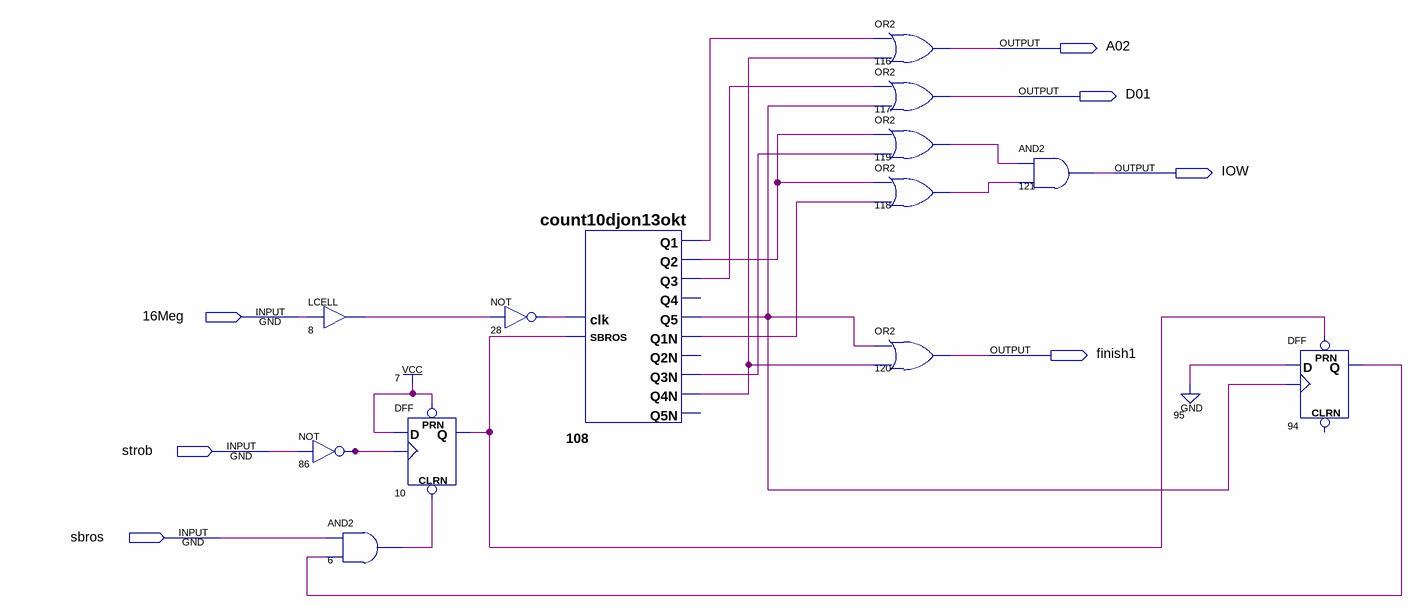
[diagram p0: schematic sheet]
// Quartus schematic reqvest13oktt.bdf as structural Verilog: 13 symbols, 7 pins
module reqvest13oktt (
  input  \16Meg ,
  input  strob,
  input  sbros,
  output A02,
  output D01,
  output IOW,
  output finish1
);

  wire n6_out, n8_out, n10_q, n28_out, n86_out, n94_q, n108_q1, n108_q1n, n108_q2, n108_q3, n108_q3n,
       n108_q4n, n108_q5, n118_out, n119_out;

  LCELL u_8 (.IN(\16Meg ), .OUT(n8_out));
  not u_86 (n86_out, strob);
  and u_6 (n6_out, sbros, n94_q);
  DFF u_10 (.CLRN(n6_out), .CLK(n86_out), .D(1'b1), .PRN(1'b1), .Q(n10_q));
  not u_28 (n28_out, n8_out);
  count10djon13okt u_108 (
    .clk(n28_out), .SBROS(n10_q), .Q1(n108_q1), .Q2(n108_q2), .Q3(n108_q3), .Q5(n108_q5), .Q1N(n108_q1n),
    .Q3N(n108_q3n), .Q4N(n108_q4n));  // open: Q4, Q2N, Q5N
  or u_116 (A02, n108_q1, n108_q4n);
  or u_117 (D01, n108_q3, n108_q5);
  or u_119 (n119_out, n108_q2, n108_q3n);
  or u_118 (n118_out, n108_q2, n108_q1n);
  or u_120 (finish1, n108_q5, n108_q4n);
  and u_121 (IOW, n119_out, n118_out);
  DFF u_94 (.CLK(n108_q5), .D(1'b0), .PRN(n10_q), .Q(n94_q));  // open: CLRN
endmodule
